# Altium project BMS_V2.1_Adv.PrjPcb (part 1 of 3)
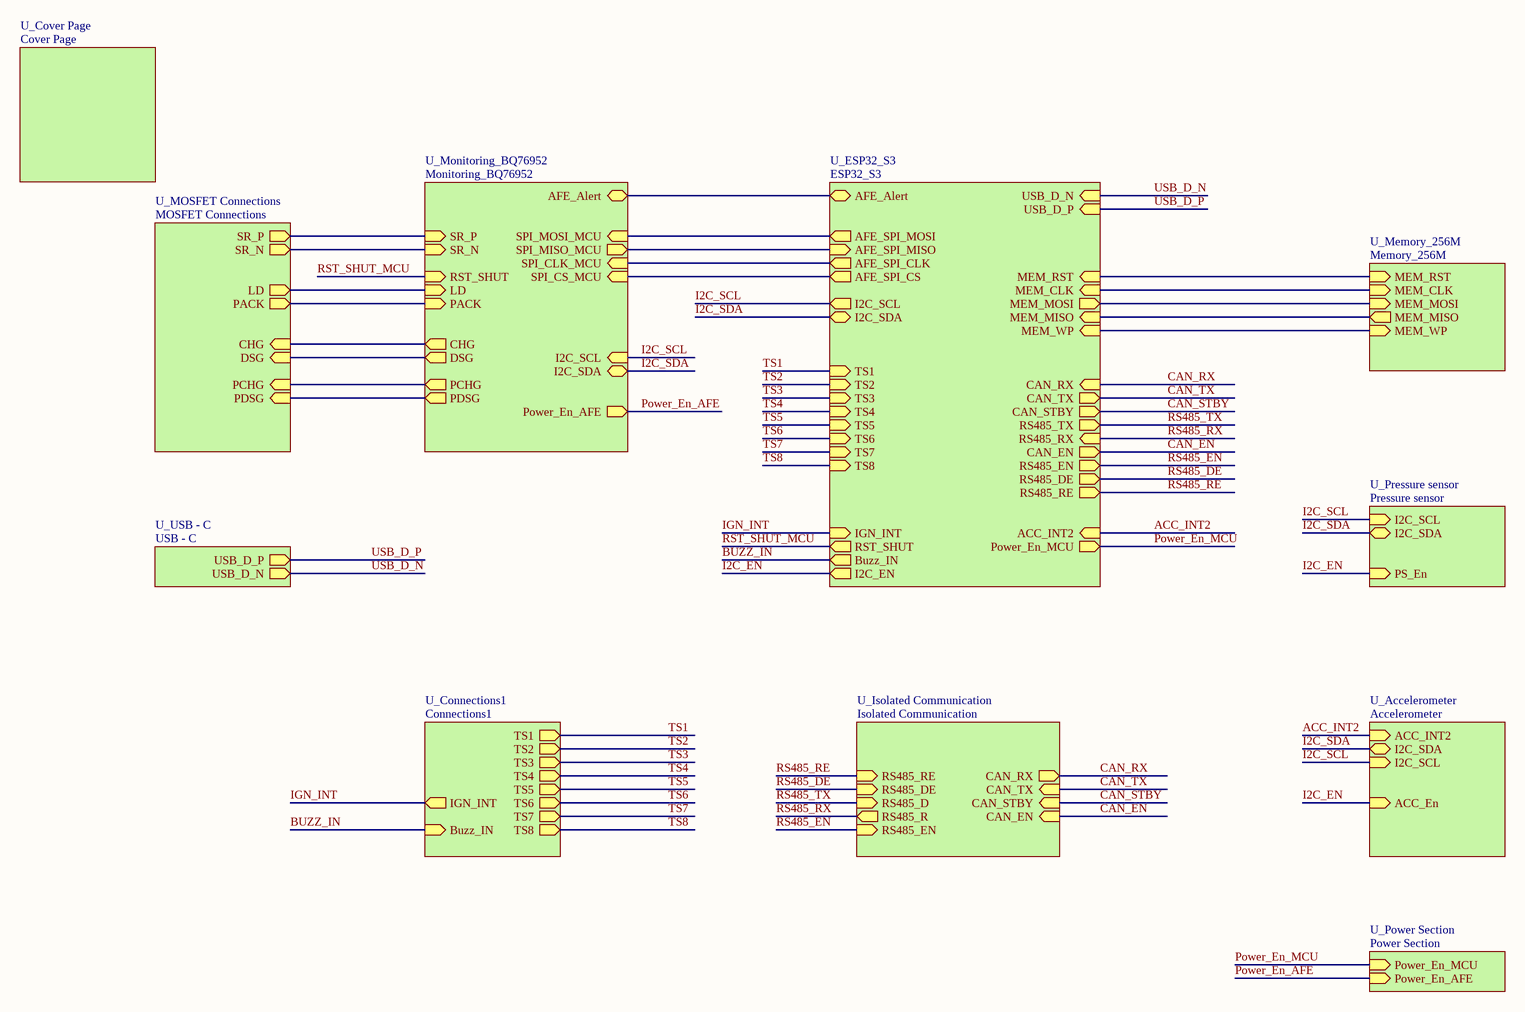
[diagram p0: Overall Connections.SchDoc]
Board Name: AlphaBMS; Configuration: 16S 100A; Configuration1: 16S 200A; Engineer: Naveenkrishna V; Revision: 0.1; Version: 1
12 sheets, 313 parts. Net scope: hierarchical (ports join the sheet entries above them; power ports are global).
Board file: BMS_V2.1_Adv.PcbDoc
Sheets:
  Overall Connections.SchDoc
    U_Cover Page = Cover Page.SchDoc
    U_Monitoring_BQ76952 = Monitoring_BQ76952.SchDoc
    U_ESP32_S3 = ESP32_S3.SchDoc
    U_Isolated Communication = Isolated Communication.SchDoc
    U_MOSFET Connections = MOSFET Connections.SchDoc
    U_USB - C = USB - C.SchDoc
    U_Power Section = Power Section.SchDoc
    U_Accelerometer = Accelerometer.SchDoc
    U_Connections1 = Connections1.SchDoc
    U_Pressure sensor = Pressure sensor.SchDoc
    U_Memory_256M = Memory_256M.SchDoc

## Sheet Overall Connections.SchDoc
size A3; SheetNumber: 1; SheetTotal: 12

### Sub-sheets
U_Accelerometer = Accelerometer: ACC_INT2 (in), I2C_SCL (in), ACC_En (in), I2C_SDA (bidir)
U_Connections1 = Connections1: TS1 (out), TS2 (out), TS3 (out), TS4 (out), TS5 (out), TS6 (out), TS7 (out), TS8 (out), Buzz_IN (in), IGN_INT (out)
U_Cover Page = Cover Page: no entries
U_ESP32_S3 = ESP32_S3: USB_D_P (in), USB_D_N (in), AFE_SPI_CS (out), AFE_SPI_MOSI (out), AFE_SPI_MISO (in), AFE_SPI_CLK (out), MEM_RST (in), MEM_MISO (in), MEM_CLK (in), MEM_WP (in), TS1 (in), TS2 (in), TS3 (in), TS4 (in), TS5 (in), TS6 (in), TS7 (in), TS8 (in), CAN_RX (in), CAN_TX (out), CAN_STBY (out), I2C_SCL (out), ACC_INT2 (in), Power_En_MCU (out), Buzz_IN (out), I2C_EN (out), MEM_MOSI (out), RST_SHUT (out), RS485_TX (out), RS485_RX (in), CAN_EN (out), RS485_EN (out), RS485_DE (out), RS485_RE (out), AFE_Alert (bidir), I2C_SDA (bidir), IGN_INT (in)
U_Isolated Communication = Isolated Communication: RS485_EN (in), RS485_RE (in), RS485_D (in), RS485_DE (in), RS485_R (out), CAN_TX (in), CAN_STBY (in), CAN_RX (out), CAN_EN (in)
U_Memory_256M = Memory_256M: MEM_RST (in), MEM_MISO (out), MEM_CLK (in), MEM_MOSI (in), MEM_WP (in)
U_Monitoring_BQ76952 = Monitoring_BQ76952: SR_P (in), SR_N (in), SPI_MOSI_MCU (in), AFE_Alert (bidir), SPI_MISO_MCU (out), SPI_CLK_MCU (in), RST_SHUT (in), CHG (out), DSG (out), SPI_CS_MCU (in), PDSG (out), PCHG (out), LD (in), PACK (in), Power_En_AFE (out), I2C_SCL (in), I2C_SDA (bidir)
U_MOSFET Connections = MOSFET Connections: SR_P (out), SR_N (out), LD (out), PACK (out), CHG (in), DSG (in), PCHG (in), PDSG (in)
U_Power Section = Power Section: Power_En_MCU (in), Power_En_AFE (in)
U_Pressure sensor = Pressure sensor: I2C_SCL (in), PS_En (in), I2C_SDA (bidir)
U_USB - C = USB - C: USB_D_P (out), USB_D_N (out)

### Nets
ACC_INT2: sheet U_ESP32_S3/ACC_INT2, sheet U_Accelerometer/ACC_INT2
BUZZ_IN: sheet U_ESP32_S3/Buzz_IN, sheet U_Connections1/Buzz_IN
CAN_EN: sheet U_ESP32_S3/CAN_EN, sheet U_Isolated Communication/CAN_EN
CAN_RX: sheet U_ESP32_S3/CAN_RX, sheet U_Isolated Communication/CAN_RX
CAN_STBY: sheet U_ESP32_S3/CAN_STBY, sheet U_Isolated Communication/CAN_STBY
CAN_TX: sheet U_ESP32_S3/CAN_TX, sheet U_Isolated Communication/CAN_TX
CHG_AFE: sheet U_Monitoring_BQ76952/CHG, sheet U_MOSFET Connections/CHG
DSG_AFE: sheet U_Monitoring_BQ76952/DSG, sheet U_MOSFET Connections/DSG
I2C_EN: sheet U_ESP32_S3/I2C_EN, sheet U_Accelerometer/ACC_En, sheet U_Pressure sensor/PS_En
I2C_SCL: sheet U_Monitoring_BQ76952/I2C_SCL, sheet U_ESP32_S3/I2C_SCL, sheet U_Accelerometer/I2C_SCL, sheet U_Pressure sensor/I2C_SCL
I2C_SDA: sheet U_Monitoring_BQ76952/I2C_SDA, sheet U_ESP32_S3/I2C_SDA, sheet U_Accelerometer/I2C_SDA, sheet U_Pressure sensor/I2C_SDA
IGN_INT: sheet U_ESP32_S3/IGN_INT, sheet U_Connections1/IGN_INT
LD_AFE: sheet U_Monitoring_BQ76952/LD, sheet U_MOSFET Connections/LD
MEM_CLK: sheet U_ESP32_S3/MEM_CLK, sheet U_Memory_256M/MEM_CLK
MEM_MISO: sheet U_ESP32_S3/MEM_MISO, sheet U_Memory_256M/MEM_MISO
MEM_MOSI: sheet U_ESP32_S3/MEM_MOSI, sheet U_Memory_256M/MEM_MOSI
MEM_RST: sheet U_ESP32_S3/MEM_RST, sheet U_Memory_256M/MEM_RST
MEM_WP: sheet U_ESP32_S3/MEM_WP, sheet U_Memory_256M/MEM_WP
PACK_AFE: sheet U_Monitoring_BQ76952/PACK, sheet U_MOSFET Connections/PACK
PCHG_AFE: sheet U_Monitoring_BQ76952/PCHG, sheet U_MOSFET Connections/PCHG
PDSG_AFE: sheet U_Monitoring_BQ76952/PDSG, sheet U_MOSFET Connections/PDSG
Power_En_AFE: sheet U_Monitoring_BQ76952/Power_En_AFE, sheet U_Power Section/Power_En_AFE
Power_En_MCU: sheet U_ESP32_S3/Power_En_MCU, sheet U_Power Section/Power_En_MCU
RS485_DE: sheet U_ESP32_S3/RS485_DE, sheet U_Isolated Communication/RS485_DE
RS485_EN: sheet U_ESP32_S3/RS485_EN, sheet U_Isolated Communication/RS485_EN
RS485_RE: sheet U_ESP32_S3/RS485_RE, sheet U_Isolated Communication/RS485_RE
RS485_RX: sheet U_ESP32_S3/RS485_RX, sheet U_Isolated Communication/RS485_R
RS485_TX: sheet U_ESP32_S3/RS485_TX, sheet U_Isolated Communication/RS485_D
RST_SHUT_MCU: sheet U_Monitoring_BQ76952/RST_SHUT, sheet U_ESP32_S3/RST_SHUT
SPI_CLK: sheet U_Monitoring_BQ76952/SPI_CLK_MCU, sheet U_ESP32_S3/AFE_SPI_CLK
SPI_CS: sheet U_Monitoring_BQ76952/SPI_CS_MCU, sheet U_ESP32_S3/AFE_SPI_CS
SPI_MISO: sheet U_Monitoring_BQ76952/SPI_MISO_MCU, sheet U_ESP32_S3/AFE_SPI_MISO
SPI_MOSI: sheet U_Monitoring_BQ76952/SPI_MOSI_MCU, sheet U_ESP32_S3/AFE_SPI_MOSI
SR_N: sheet U_Monitoring_BQ76952/SR_N, sheet U_MOSFET Connections/SR_N
SR_P: sheet U_Monitoring_BQ76952/SR_P, sheet U_MOSFET Connections/SR_P
TS1: sheet U_ESP32_S3/TS1, sheet U_Connections1/TS1
TS2: sheet U_ESP32_S3/TS2, sheet U_Connections1/TS2
TS3: sheet U_ESP32_S3/TS3, sheet U_Connections1/TS3
TS4: sheet U_ESP32_S3/TS4, sheet U_Connections1/TS4
TS5: sheet U_ESP32_S3/TS5, sheet U_Connections1/TS5
TS6: sheet U_ESP32_S3/TS6, sheet U_Connections1/TS6
TS7: sheet U_ESP32_S3/TS7, sheet U_Connections1/TS7
TS8: sheet U_ESP32_S3/TS8, sheet U_Connections1/TS8
USB_D_N: sheet U_ESP32_S3/USB_D_N, sheet U_USB - C/USB_D_N
USB_D_P: sheet U_ESP32_S3/USB_D_P, sheet U_USB - C/USB_D_P
NetU1_25: sheet U_Monitoring_BQ76952/AFE_Alert, sheet U_ESP32_S3/AFE_Alert

## Sheet Cover Page.SchDoc
size A3; SheetNumber: 2; SheetTotal: 12
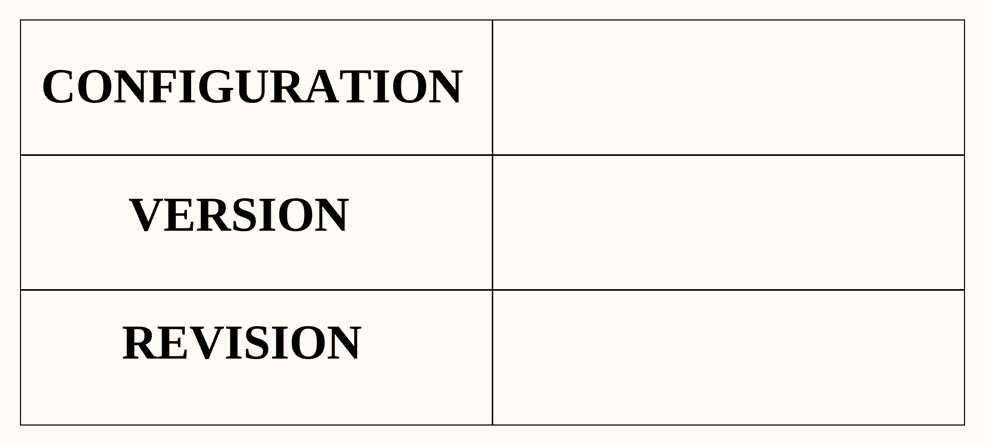
[diagram p1: Cover Page.SchDoc]

### Notes on the sheet
- CONFIGURATION
- VERSION
- REVISION

## Sheet Monitoring_BQ76952.SchDoc
size A3; SheetNumber: 4; SheetTotal: 12
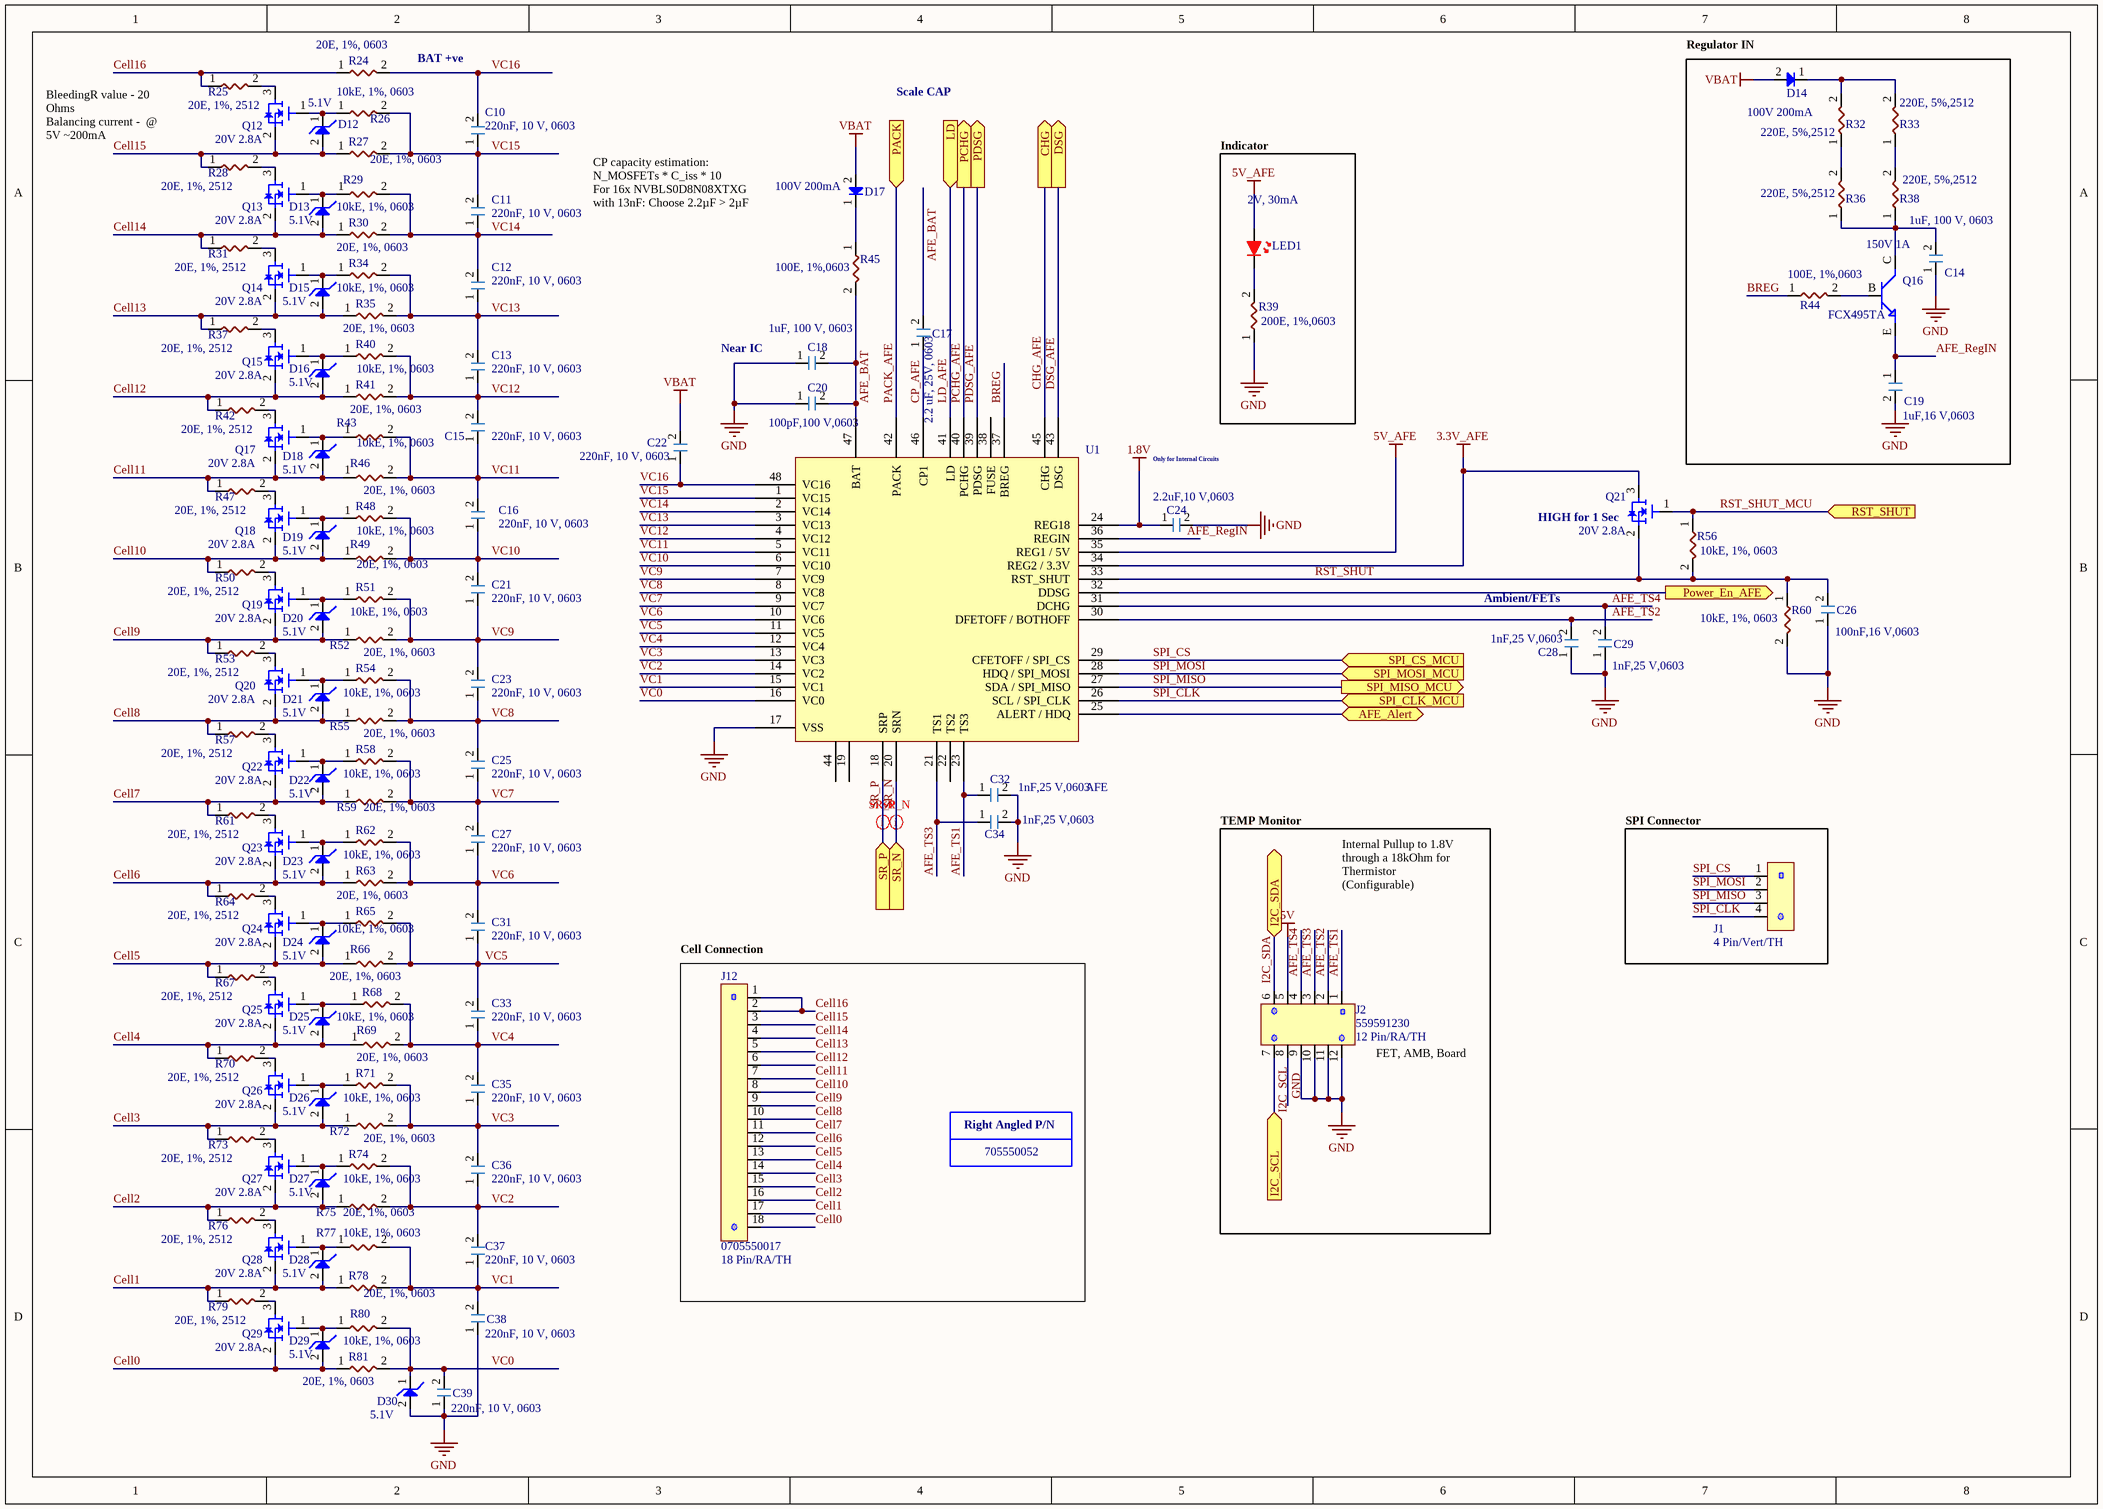
[diagram p2: Monitoring_BQ76952.SchDoc]

### Parts
C10  Value Display: 220nF, 10 V, 0603  [CAPC1608X05N 0603]  (hidden comment: GCJ188R71A224KA01D)
C11  Value Display: 220nF, 10 V, 0603  [CAPC1608X05N 0603]  (hidden comment: GCJ188R71A224KA01D)
C12  Value Display: 220nF, 10 V, 0603  [CAPC1608X05N 0603]  (hidden comment: GCJ188R71A224KA01D)
C13  Value Display: 220nF, 10 V, 0603  [CAPC1608X05N 0603]  (hidden comment: GCJ188R71A224KA01D)
C14  Value Display: 1uF, 100 V, 0603  [CAPC3216X19N 1206]  (hidden comment: GCJ31CR72A105KA01K)
C15  Value Display: 220nF, 10 V, 0603  [CAPC1608X05N 0603]  (hidden comment: GCJ188R71A224KA01D)
C16  Value Display: 220nF, 10 V, 0603  [CAPC1608X05N 0603]  (hidden comment: GCJ188R71A224KA01D)
C17  Value Display: 2.2 uF, 25V, 0603  [CAPC1608X05N 0603]  (hidden comment: GRM188Z71E225KE43D)
C18  Value Display: 1uF, 100 V, 0603  [CAPC3216X19N 1206]  (hidden comment: GCJ31CR72A105KA01K)
C19  Value Display: 1uF,16 V,0603  [CAPC1608X05N 0603]  (hidden comment: CGA3E1X7R1C105K080AC)
C20  Value Display: 100pF,100 V,0603  [CAPC1608X05N 0603]  (hidden comment: GCM1885C2A101JA16J)
C21  Value Display: 220nF, 10 V, 0603  [CAPC1608X05N 0603]  (hidden comment: GCJ188R71A224KA01D)
C22  Value Display: 220nF, 10 V, 0603  [CAPC1608X05N 0603]  (hidden comment: GCJ188R71A224KA01D)
C23  Value Display: 220nF, 10 V, 0603  [CAPC1608X05N 0603]  (hidden comment: GCJ188R71A224KA01D)
C24  Value Display: 2.2uF,10 V,0603  [CAPC1608X05N 0603]  (hidden comment: GRM188R71A225KE15D)
C25  Value Display: 220nF, 10 V, 0603  [CAPC1608X05N 0603]  (hidden comment: GCJ188R71A224KA01D)
C26  Value Display: 100nF,16 V,0603  [CAPC1608X05N 0603]  (hidden comment: CC0603KRX7R7BB104)
C27  Value Display: 220nF, 10 V, 0603  [CAPC1608X05N 0603]  (hidden comment: GCJ188R71A224KA01D)
C28  Value Display: 1nF,25 V,0603  [CAPC1608X05N 0603]  (hidden comment: C0603C102J3GACAUTO)
C29  Value Display: 1nF,25 V,0603  [CAPC1608X05N 0603]  (hidden comment: C0603C102J3GACAUTO)
C31  Value Display: 220nF, 10 V, 0603  [CAPC1608X05N 0603]  (hidden comment: GCJ188R71A224KA01D)
C32  Value Display: 1nF,25 V,0603  [CAPC1608X05N 0603]  (hidden comment: C0603C102J3GACAUTO)
C33  Value Display: 220nF, 10 V, 0603  [CAPC1608X05N 0603]  (hidden comment: GCJ188R71A224KA01D)
C34  Value Display: 1nF,25 V,0603  [CAPC1608X05N 0603]  (hidden comment: C0603C102J3GACAUTO)
C35  Value Display: 220nF, 10 V, 0603  [CAPC1608X05N 0603]  (hidden comment: GCJ188R71A224KA01D)
C36  Value Display: 220nF, 10 V, 0603  [CAPC1608X05N 0603]  (hidden comment: GCJ188R71A224KA01D)
C37  Value Display: 220nF, 10 V, 0603  [CAPC1608X05N 0603]  (hidden comment: GCJ188R71A224KA01D)
C38  Value Display: 220nF, 10 V, 0603  [CAPC1608X05N 0603]  (hidden comment: GCJ188R71A224KA01D)
C39  Value Display: 220nF, 10 V, 0603  [CAPC1608X05N 0603]  (hidden comment: GCJ188R71A224KA01D)
D12  Value Display: 5.1V  [DIODE_SOD323]  (hidden comment: MM3Z5V1ST1G)
D13  Value Display: 5.1V  [DIODE_SOD323]  (hidden comment: MM3Z5V1ST1G)
D14  Value Display: 100V 200mA  [DIODE_SOD323]  (hidden comment: SBAS16HT1G)
D15  Value Display: 5.1V  [DIODE_SOD323]  (hidden comment: MM3Z5V1ST1G)
D16  Value Display: 5.1V  [DIODE_SOD323]  (hidden comment: MM3Z5V1ST1G)
D17  Value Display: 100V 200mA  [DIODE_SOD323]  (hidden comment: SBAS16HT1G)
D18  Value Display: 5.1V  [DIODE_SOD323]  (hidden comment: MM3Z5V1ST1G)
D19  Value Display: 5.1V  [DIODE_SOD323]  (hidden comment: MM3Z5V1ST1G)
D20  Value Display: 5.1V  [DIODE_SOD323]  (hidden comment: MM3Z5V1ST1G)
D21  Value Display: 5.1V  [DIODE_SOD323]  (hidden comment: MM3Z5V1ST1G)
D22  Value Display: 5.1V  [DIODE_SOD323]  (hidden comment: MM3Z5V1ST1G)
D23  Value Display: 5.1V  [DIODE_SOD323]  (hidden comment: MM3Z5V1ST1G)
D24  Value Display: 5.1V  [DIODE_SOD323]  (hidden comment: MM3Z5V1ST1G)
D25  Value Display: 5.1V  [DIODE_SOD323]  (hidden comment: MM3Z5V1ST1G)
D26  Value Display: 5.1V  [DIODE_SOD323]  (hidden comment: MM3Z5V1ST1G)
D27  Value Display: 5.1V  [DIODE_SOD323]  (hidden comment: MM3Z5V1ST1G)
D28  Value Display: 5.1V  [DIODE_SOD323]  (hidden comment: MM3Z5V1ST1G)
D29  Value Display: 5.1V  [DIODE_SOD323]  (hidden comment: MM3Z5V1ST1G)
D30  Value Display: 5.1V  [DIODE_SOD323]  (hidden comment: MM3Z5V1ST1G)
J1  Value Display: 4 Pin/Vert/TH  [Con_61900411121]  (hidden comment: 61900411121)
J2  559591230  Value Display: 12 Pin/RA/TH  [Con_0559591230]
J12  0705550017  Value Display: 18 Pin/RA/TH  [Con_705550017]
LED1  Value Display: 2V, 30mA  [DIOC1610X08N LED]  (hidden comment: 150060RS75000)
Q12  Value Display: 20V 2.8A  [SOT95P255X140-3N]  (hidden comment: DMG2302UK-7)
Q13  Value Display: 20V 2.8A  [SOT95P255X140-3N]  (hidden comment: DMG2302UK-7)
Q14  Value Display: 20V 2.8A  [SOT95P255X140-3N]  (hidden comment: DMG2302UK-7)
Q15  Value Display: 20V 2.8A  [SOT95P255X140-3N]  (hidden comment: DMG2302UK-7)
Q16  FCX495TA  Value Display: 150V 1A  [SOT89-150P410X160-3N]
Q17  Value Display: 20V 2.8A  [SOT95P255X140-3N]  (hidden comment: DMG2302UK-7)
Q18  Value Display: 20V 2.8A  [SOT95P255X140-3N]  (hidden comment: DMG2302UK-7)
Q19  Value Display: 20V 2.8A  [SOT95P255X140-3N]  (hidden comment: DMG2302UK-7)
Q20  Value Display: 20V 2.8A  [SOT95P255X140-3N]  (hidden comment: DMG2302UK-7)
Q21  Value Display: 20V 2.8A  [SOT95P255X140-3N]  (hidden comment: DMG2302UK-7)
Q22  Value Display: 20V 2.8A  [SOT95P255X140-3N]  (hidden comment: DMG2302UK-7)
Q23  Value Display: 20V 2.8A  [SOT95P255X140-3N]  (hidden comment: DMG2302UK-7)
Q24  Value Display: 20V 2.8A  [SOT95P255X140-3N]  (hidden comment: DMG2302UK-7)
Q25  Value Display: 20V 2.8A  [SOT95P255X140-3N]  (hidden comment: DMG2302UK-7)
Q26  Value Display: 20V 2.8A  [SOT95P255X140-3N]  (hidden comment: DMG2302UK-7)
Q27  Value Display: 20V 2.8A  [SOT95P255X140-3N]  (hidden comment: DMG2302UK-7)
Q28  Value Display: 20V 2.8A  [SOT95P255X140-3N]  (hidden comment: DMG2302UK-7)
Q29  Value Display: 20V 2.8A  [SOT95P255X140-3N]  (hidden comment: DMG2302UK-7)
R24  Value Display: 20E, 1%, 0603  [RESC1608X05N 0603]  (hidden comment: CRCW060320R0FKEAHP)
R25  Value Display: 20E, 1%, 2512  [RESC6332X07N 2512]  (hidden comment: RC2512FK-0720RL)
R26  Value Display: 10kE, 1%, 0603  [RESC1608X05N 0603]  (hidden comment: CRCW060310K0FKEA)
R27  Value Display: 20E, 1%, 0603  [RESC1608X05N 0603]  (hidden comment: CRCW060320R0FKEAHP)
R28  Value Display: 20E, 1%, 2512  [RESC6332X07N 2512]  (hidden comment: RC2512FK-0720RL)
R29  Value Display: 10kE, 1%, 0603  [RESC1608X05N 0603]  (hidden comment: CRCW060310K0FKEA)
R30  Value Display: 20E, 1%, 0603  [RESC1608X05N 0603]  (hidden comment: CRCW060320R0FKEAHP)
R31  Value Display: 20E, 1%, 2512  [RESC6332X07N 2512]  (hidden comment: RC2512FK-0720RL)
R32  Value Display: 220E, 5%,2512  [RESC6332X07N 2512]  (hidden comment: CRCW2512220RJNEG)
R33  Value Display: 220E, 5%,2512  [RESC6332X07N 2512]  (hidden comment: CRCW2512220RJNEG)
R34  Value Display: 10kE, 1%, 0603  [RESC1608X05N 0603]  (hidden comment: CRCW060310K0FKEA)
R35  Value Display: 20E, 1%, 0603  [RESC1608X05N 0603]  (hidden comment: CRCW060320R0FKEAHP)
R36  Value Display: 220E, 5%,2512  [RESC6332X07N 2512]  (hidden comment: CRCW2512220RJNEG)
R37  Value Display: 20E, 1%, 2512  [RESC6332X07N 2512]  (hidden comment: RC2512FK-0720RL)
R38  Value Display: 220E, 5%,2512  [RESC6332X07N 2512]  (hidden comment: CRCW2512220RJNEG)
R39  Value Display: 200E, 1%,0603  [RESC1608X05N 0603]  (hidden comment: AC0603FR-10200RL)
R40  Value Display: 10kE, 1%, 0603  [RESC1608X05N 0603]  (hidden comment: CRCW060310K0FKEA)
R41  Value Display: 20E, 1%, 0603  [RESC1608X05N 0603]  (hidden comment: CRCW060320R0FKEAHP)
R42  Value Display: 20E, 1%, 2512  [RESC6332X07N 2512]  (hidden comment: RC2512FK-0720RL)
R43  Value Display: 10kE, 1%, 0603  [RESC1608X05N 0603]  (hidden comment: CRCW060310K0FKEA)
R44  Value Display: 100E, 1%,0603  [RESC1608X05N 0603]  (hidden comment: AF0603FR-07100RL)
R45  Value Display: 100E, 1%,0603  [RESC1608X05N 0603]  (hidden comment: AF0603FR-07100RL)
R46  Value Display: 20E, 1%, 0603  [RESC1608X05N 0603]  (hidden comment: CRCW060320R0FKEAHP)
R47  Value Display: 20E, 1%, 2512  [RESC6332X07N 2512]  (hidden comment: RC2512FK-0720RL)
R48  Value Display: 10kE, 1%, 0603  [RESC1608X05N 0603]  (hidden comment: CRCW060310K0FKEA)
R49  Value Display: 20E, 1%, 0603  [RESC1608X05N 0603]  (hidden comment: CRCW060320R0FKEAHP)
R50  Value Display: 20E, 1%, 2512  [RESC6332X07N 2512]  (hidden comment: RC2512FK-0720RL)
R51  Value Display: 10kE, 1%, 0603  [RESC1608X05N 0603]  (hidden comment: CRCW060310K0FKEA)
R52  Value Display: 20E, 1%, 0603  [RESC1608X05N 0603]  (hidden comment: CRCW060320R0FKEAHP)
R53  Value Display: 20E, 1%, 2512  [RESC6332X07N 2512]  (hidden comment: RC2512FK-0720RL)
R54  Value Display: 10kE, 1%, 0603  [RESC1608X05N 0603]  (hidden comment: CRCW060310K0FKEA)
R55  Value Display: 20E, 1%, 0603  [RESC1608X05N 0603]  (hidden comment: CRCW060320R0FKEAHP)
R56  Value Display: 10kE, 1%, 0603  [RESC1608X05N 0603]  (hidden comment: CRCW060310K0FKEA)
R57  Value Display: 20E, 1%, 2512  [RESC6332X07N 2512]  (hidden comment: RC2512FK-0720RL)
R58  Value Display: 10kE, 1%, 0603  [RESC1608X05N 0603]  (hidden comment: CRCW060310K0FKEA)
R59  Value Display: 20E, 1%, 0603  [RESC1608X05N 0603]  (hidden comment: CRCW060320R0FKEAHP)
R60  Value Display: 10kE, 1%, 0603  [RESC1608X05N 0603]  (hidden comment: CRCW060310K0FKEA)
R61  Value Display: 20E, 1%, 2512  [RESC6332X07N 2512]  (hidden comment: RC2512FK-0720RL)
R62  Value Display: 10kE, 1%, 0603  [RESC1608X05N 0603]  (hidden comment: CRCW060310K0FKEA)
R63  Value Display: 20E, 1%, 0603  [RESC1608X05N 0603]  (hidden comment: CRCW060320R0FKEAHP)
R64  Value Display: 20E, 1%, 2512  [RESC6332X07N 2512]  (hidden comment: RC2512FK-0720RL)
R65  Value Display: 10kE, 1%, 0603  [RESC1608X05N 0603]  (hidden comment: CRCW060310K0FKEA)
R66  Value Display: 20E, 1%, 0603  [RESC1608X05N 0603]  (hidden comment: CRCW060320R0FKEAHP)
R67  Value Display: 20E, 1%, 2512  [RESC6332X07N 2512]  (hidden comment: RC2512FK-0720RL)
R68  Value Display: 10kE, 1%, 0603  [RESC1608X05N 0603]  (hidden comment: CRCW060310K0FKEA)
R69  Value Display: 20E, 1%, 0603  [RESC1608X05N 0603]  (hidden comment: CRCW060320R0FKEAHP)
R70  Value Display: 20E, 1%, 2512  [RESC6332X07N 2512]  (hidden comment: RC2512FK-0720RL)
R71  Value Display: 10kE, 1%, 0603  [RESC1608X05N 0603]  (hidden comment: CRCW060310K0FKEA)
R72  Value Display: 20E, 1%, 0603  [RESC1608X05N 0603]  (hidden comment: CRCW060320R0FKEAHP)
R73  Value Display: 20E, 1%, 2512  [RESC6332X07N 2512]  (hidden comment: RC2512FK-0720RL)
R74  Value Display: 10kE, 1%, 0603  [RESC1608X05N 0603]  (hidden comment: CRCW060310K0FKEA)
R75  Value Display: 20E, 1%, 0603  [RESC1608X05N 0603]  (hidden comment: CRCW060320R0FKEAHP)
R76  Value Display: 20E, 1%, 2512  [RESC6332X07N 2512]  (hidden comment: RC2512FK-0720RL)
R77  Value Display: 10kE, 1%, 0603  [RESC1608X05N 0603]  (hidden comment: CRCW060310K0FKEA)
R78  Value Display: 20E, 1%, 0603  [RESC1608X05N 0603]  (hidden comment: CRCW060320R0FKEAHP)
R79  Value Display: 20E, 1%, 2512  [RESC6332X07N 2512]  (hidden comment: RC2512FK-0720RL)
R80  Value Display: 10kE, 1%, 0603  [RESC1608X05N 0603]  (hidden comment: CRCW060310K0FKEA)
R81  Value Display: 20E, 1%, 0603  [RESC1608X05N 0603]  (hidden comment: CRCW060320R0FKEAHP)
U1  Value Display: AFE  [TSQFP50P900X900X120-48N]  (hidden comment: BQ7695203)

### Blocks framed on the sheet
Regulator IN: C14 C19 D14 Q16 R32 R33 R36 R38 R44
Indicator: LED1 R39
TEMP Monitor: J2
SPI Connector: J1

### Ports
AFE_Alert (bidir), CHG (out), DSG (out), I2C_SCL (in), I2C_SDA (bidir), LD (in), PACK (in), PCHG (out), PDSG (out), Power_En_AFE (out), RST_SHUT (in), SPI_CLK_MCU (in), SPI_CS_MCU (in), SPI_MISO_MCU (out), SPI_MOSI_MCU (in), SR_N (in), SR_P (in)

### Nets
1.8V: C24.1 U1.24(REG18)
3.3V_AFE: Q21.3(Drain) U1.34(REG2_/_3.3V)
5V: J2.5
5V_AFE: LED1.2(Anode) U1.35(REG1_/_5V)
GND: C14.1 C18.1 C19.2 C20.1 C24.2 C26.1 C28.1 C29.1 C32.2 C34.2 C38.1 C39.1 D30.2(Anode) J2.8 J2.9 J2.10 J2.11 J2.12 R39.1 R60.2 U1.17(VSS)
VBAT: C22.2 D14.2(Anode) D17.2(Anode)
AFE_BAT: C17.2 C18.2 C20.2 R45.2 U1.47(BAT)
AFE_RegIN: C19.1 Q16.E(Emitter) U1.36(REGIN)
AFE_TS1: C32.1 J2.1 U1.23(TS3)
AFE_TS2: C28.2 J2.2 U1.30(DFETOFF_/_BOTHOFF)
AFE_TS3: C34.1 J2.3 U1.21(TS1)
AFE_TS4: C29.2 J2.4 U1.31(DCHG)
BREG: R44.1 U1.37(BREG)
Cell0: D29.2(Anode) J12.18(Cell_17) Q29.2(Source) R81.1
Cell1: D28.2(Anode) J12.17(Cell_16) Q28.2(Source) R78.1 R79.1
Cell2: D27.2(Anode) J12.16(Cell_15) Q27.2(Source) R75.1 R76.1
Cell3: D26.2(Anode) J12.15(Cell_14) Q26.2(Source) R72.1 R73.1
Cell4: D25.2(Anode) J12.14(Cell_13) Q25.2(Source) R69.1 R70.1
Cell5: D24.2(Anode) J12.13(Cell_12) Q24.2(Source) R66.1 R67.1
Cell6: D23.2(Anode) J12.12(Cell_11) Q23.2(Source) R63.1 R64.1
Cell7: D22.2(Anode) J12.11(Cell_10) Q22.2(Source) R59.1 R61.1
Cell8: D21.2(Anode) J12.10(Cell_9) Q20.2(Source) R55.1 R57.1
Cell9: D20.2(Anode) J12.9(Cell_8) Q19.2(Source) R52.1 R53.1
Cell10: D19.2(Anode) J12.8(Cell_7) Q18.2(Source) R49.1 R50.1
Cell11: D18.2(Anode) J12.7(Cell_6) Q17.2(Source) R46.1 R47.1
Cell12: D16.2(Anode) J12.6(Cell_5) Q15.2(Source) R41.1 R42.1
Cell13: D15.2(Anode) J12.5(Cell_4) Q14.2(Source) R35.1 R37.1
Cell14: D13.2(Anode) J12.4(Cell_3) Q13.2(Source) R30.1 R31.1
Cell15: D12.2(Anode) J12.3(Cell_2) Q12.2(Source) R27.1 R28.1
Cell16: J12.1(Cell_0) J12.2(Cell_1) R24.1 R25.1
CHG_AFE: U1.45(CHG) ; port CHG
CP_AFE: C17.1 U1.46(CP1)
DSG_AFE: U1.43(DSG) ; port DSG
I2C_SCL: J2.7 ; port I2C_SCL
I2C_SDA: J2.6 ; port I2C_SDA
LD_AFE: U1.41(LD) ; port LD
PACK_AFE: U1.42(PACK) ; port PACK
PCHG_AFE: U1.40(PCHG) ; port PCHG
PDSG_AFE: U1.39(PDSG) ; port PDSG
Power_En_AFE: U1.32(DDSG) ; port Power_En_AFE
RST_SHUT: C26.2 Q21.2(Source) R56.2 R60.1 U1.33(RST_SHUT)
RST_SHUT_MCU: Q21.1(Gate) R56.1 ; port RST_SHUT
SPI_CLK: J1.4 U1.26(SCL_/_SPI_CLK) ; port SPI_CLK_MCU
SPI_CS: J1.1 U1.29(CFETOFF_/_SPI_CS) ; port SPI_CS_MCU
SPI_MISO: J1.3 U1.27(SDA_/_SPI_MISO) ; port SPI_MISO_MCU
SPI_MOSI: J1.2 U1.28(HDQ_/_SPI_MOSI) ; port SPI_MOSI_MCU
SR_N: U1.20(SRN) ; port SR_N
SR_P: U1.18(SRP) ; port SR_P
VC0: C39.2 D30.1(Cathode) R80.2 R81.2 U1.16(VC0)
VC1: C37.1 C38.2 R77.2 R78.2 U1.15(VC1)
VC2: C36.1 C37.2 R74.2 R75.2 U1.14(VC2)
VC3: C35.1 C36.2 R71.2 R72.2 U1.13(VC3)
VC4: C33.1 C35.2 R68.2 R69.2 U1.12(VC4)
VC5: C31.1 C33.2 R65.2 R66.2 U1.11(VC5)
VC6: C27.1 C31.2 R62.2 R63.2 U1.10(VC6)
VC7: C25.1 C27.2 R58.2 R59.2 U1.9(VC7)
VC8: C23.1 C25.2 R54.2 R55.2 U1.8(VC8)
VC9: C21.1 C23.2 R51.2 R52.2 U1.7(VC9)
VC10: C16.1 C21.2 R48.2 R49.2 U1.6(VC10)
VC11: C15.1 C16.2 R43.2 R46.2 U1.5(VC11)
VC12: C13.1 C15.2 R40.2 R41.2 U1.4(VC12)
VC13: C12.1 C13.2 R34.2 R35.2 U1.3(VC13)
VC14: C11.1 C12.2 R29.2 R30.2 U1.2(VC14)
VC15: C10.1 C11.2 R26.2 R27.2 U1.1(VC15)
VC16: C10.2 C22.1 R24.2 U1.48(VC16)
NetC14_2: C14.2 Q16.C(Collector) R36.1 R38.1
NetD12_1: D12.1(Cathode) Q12.1(Gate) R26.1
NetD13_1: D13.1(Cathode) Q13.1(Gate) R29.1
NetD14_1: D14.1(Cathode) R32.2 R33.2
NetD15_1: D15.1(Cathode) Q14.1(Gate) R34.1
NetD16_1: D16.1(Cathode) Q15.1(Gate) R40.1
NetD17_1: D17.1(Cathode) R45.1
NetD18_1: D18.1(Cathode) Q17.1(Gate) R43.1
NetD19_1: D19.1(Cathode) Q18.1(Gate) R48.1
NetD20_1: D20.1(Cathode) Q19.1(Gate) R51.1
NetD21_1: D21.1(Cathode) Q20.1(Gate) R54.1
NetD22_1: D22.1(Cathode) Q22.1(Gate) R58.1
NetD23_1: D23.1(Cathode) Q23.1(Gate) R62.1
NetD24_1: D24.1(Cathode) Q24.1(Gate) R65.1
NetD25_1: D25.1(Cathode) Q25.1(Gate) R68.1
NetD26_1: D26.1(Cathode) Q26.1(Gate) R71.1
NetD27_1: D27.1(Cathode) Q27.1(Gate) R74.1
NetD28_1: D28.1(Cathode) Q28.1(Gate) R77.1
NetD29_1: D29.1(Cathode) Q29.1(Gate) R80.1
NetLED1_1: LED1.1(Cathode) R39.2
NetQ12_3: Q12.3(Drain) R25.2
NetQ13_3: Q13.3(Drain) R28.2
NetQ14_3: Q14.3(Drain) R31.2
NetQ15_3: Q15.3(Drain) R37.2
NetQ16_B: Q16.B(Base) R44.2
NetQ17_3: Q17.3(Drain) R42.2
NetQ18_3: Q18.3(Drain) R47.2
NetQ19_3: Q19.3(Drain) R50.2
NetQ20_3: Q20.3(Drain) R53.2
NetQ22_3: Q22.3(Drain) R57.2
NetQ23_3: Q23.3(Drain) R61.2
NetQ24_3: Q24.3(Drain) R64.2
NetQ25_3: Q25.3(Drain) R67.2
NetQ26_3: Q26.3(Drain) R70.2
NetQ27_3: Q27.3(Drain) R73.2
NetQ28_3: Q28.3(Drain) R76.2
NetQ29_3: Q29.3(Drain) R79.2
NetR32_1: R32.1 R36.2
NetR33_1: R33.1 R38.2
NetU1_25: U1.25(ALERT_/_HDQ) ; port AFE_Alert

Not connected (* = marked no-connect by the designer): U1 19 22(TS2) 38(FUSE) 44

### Layout directives
differential pair: SR_N, SR_P

### Notes on the sheet
- BAT +ve
- Scale CAP
- BleedingR value - 20 Ohms
  Balancing current -  @ 5V ~200mA
- CP capacity estimation: N_MOSFETs * C_iss * 10
  For 16x NVBLS0D8N08XTXG with 13nF: Choose 2.2µF > 2µF
- Near IC
- Only for Internal Circuits
- (near Q21) HIGH for 1 Sec
- Ambient/FETs
- Internal Pullup to 1.8V through a 18kOhm for  Thermistor (Configurable)
- (near J12) Cell Connection
- (near J2) FET, AMB, Board
- Right Angled P/N
- 705550052

### Library data of the parts
C10-C13 C15 C16 C21-C23 C25 C27 C31 C33 C35-C39 = Cap_GCJ188R71A224KA01D: Multilayer Ceramic Capacitor, 220 nF, 10V, ±10%,  X7R 0603 [1608 Metric]; Manufacturer: Murata; Value: 220 nF; AEC-Q: 200; Max Temp: 125 degC; Min Temp: -55 degC; Polarized: No; Manufacturer Part Number: GCJ188R71A224KA01D; Tolerance: 10%; Package: 0603; Category: Capacitor; RoHS: Yes; Voltage: 10V; Supplier: Mouser; ComponentLink1Description: Datasheet; ComponentLink1URL: https://search.murata.co.jp/Ceramy/image/img/A01X/G101/ENG/GCJ188R71A224KA01-02B.pdf; Temp Coefficient: X7R; Supplier 1 pricing per Unit: 16.28 INR; Supplier 1: Digikey; Value 1: GCJ188R71A224KA01D; Supplier 1 Part Number: 490-GCJ188R71A224KA01DTR-ND; Supplier Part Number: 81-GCJ188R71A224KA1D; Supplier pricing per Unit: 12.51 INR; Mount Type: Surface Mount; Technology: Ceramic
C14 C18 = Cap_GCJ31CR72A105KA01K: Multilayer Ceramic Capacitor, 1uF, 100V, ±10%,  X7R 1206 [3216 Metric]; Manufacturer: Murata; AEC-Q: 200; Max Temp: 125 degC; Min Temp: -55 degC; Polarized: No; Value: 1uF; Tolerance: 10%; Manufacturer Part Number: GCJ31CR72A105KA01K; Package: 1206; Category: Capacitor; Voltage: 100V; Temp Coefficient: X7R; RoHS: Yes; Supplier: Mouser; Supplier 1 pricing per Unit: 40.02 INR; ComponentLink1Description: Datasheet; ComponentLink1URL: https://search.murata.co.jp/Ceramy/image/img/A01X/G101/ENG/GCJ31CR72A105KA01-01.pdf; Supplier 1: Digikey; Value 1: GCJ31CR72A105KA01K; Supplier 1 Part Number: 490-GCJ31CR72A105KA01KCT-ND; Supplier Part Number: 81-GCJ31CR72A105KA1K; Supplier pricing per Unit: 40.3 INR; Mount Type: Surface Mount; Technology: Ceramic
C17 = Cap_GRM188Z71E225KE43D: 2.2 µF ±10% 25V Ceramic Capacitor X7R 0603 (1608 Metric); Manufacturer: Murata; AEC-Q: NA; Max Temp: 125 degC; Min Temp: -55 degC; Polarized: No; Value: 2.2uF; Category: Capacitor; ComponentLink1Description: Datasheet; ComponentLink1URL: https://search.murata.co.jp/Ceramy/image/img/A01X/G101/ENG/GRM188Z71E225KE43-01A.pdf; Manufacturer Part Number: GRM188Z71E225KE43D; Mount Type: Surface Mount; Package: 0603; RoHS: Yes; Supplier 1: Digikey; Supplier 1 Part Number: 490-GRM188Z71E225KE43DCT-ND; Supplier 1 pricing per Unit: 19.34 INR; Supplier: Mouser; Supplier Part Number: 81-GRM188Z71E225KE3D; Supplier pricing per Unit: 19.18 INR; Technology: Ceramic; Temp Coefficient: X7R; Tolerance: 10%; Value 1: GRM188Z71E225KE43D; Voltage: 25V
C19 = Cap_CGA3E1X7R1C105K080AC: Multilayer Ceramic Capacitor, 1uF, 16V, ±10%,  X7R 0603 [1608 Metric]; Manufacturer: TDK Corporation; Polarized: No; AEC-Q: 200; Min Temp: -55 degC; Max Temp: 125 degC; Value: 1 uF; Manufacturer Part Number: CGA3E1X7R1C105K080AC; Package: 0603; RoHS: Yes; Mount Type: Surface Mount; Supplier 1: Digikey; Voltage: 16V; Tolerance: 10%; Technology: Ceramic; Value 1: CGA3E1X7R1C105K080AC; Category: Capacitor; ComponentLink1Description: Datasheet; ComponentLink1URL: https://product.tdk.com/system/files/dam/doc/product/capacitor/ceramic/mlcc/catalog/mlcc_automotive_general_en.pdf; Supplier 1 Part Number: 445-12539-1-ND; Supplier 1 pricing per Unit: 10.84 INR; Supplier: Mouser; Supplier Part Number: 810-CGA3E1X7R1C105AC; Supplier pricing per Unit: 10.01 INR; Temp Coefficient: X7R
C20 = Cap_GCM1885C2A101JA16J: Multilayer Ceramic Capacitor, 100 pF, 100V, ±5%,  C0G 0603 [1608 Metric]; Manufacturer: Murata; Value: 100pF; AEC-Q: 200; Max Temp: 125 degC; Min Temp: -55 degC; Polarized: No; Category: Capacitor; Tolerance: 5%; Voltage: 100V; Manufacturer Part Number: GCM1885C2A101JA16J; Package: 0603; RoHS: Yes; Supplier: Mouser; ComponentLink1Description: Datasheet; ComponentLink1URL: https://www.murata.com/-/media/webrenewal/support/library/catalog/products/k35e.ashx?la=en-us&cvid=20200508021757000000; Temp Coefficient: C0G; Supplier 1 pricing per Unit: 8.33 INR; Supplier 1: Digikey; Value 1: GCM1885C2A101JA16J; Supplier 1 Part Number: 490-GCM1885C2A101JA16JCT-ND; Supplier Part Number: 81-GCM1885C2A101JA6J; Supplier pricing per Unit: 8.33 INR; Mount Type: Surface Mount; Technology: Ceramic
C24 = Cap_GRM188R71A225KE15D: Multilayer Ceramic Capacitor, 2.2 uF, 10 V, ± 10%, X7R, 0603 [1608 Metric]; Manufacturer: Murata; Value: 2.2uF; Voltage: 10V; AEC-Q: NA; Max Temp: 125 degC; Min Temp: -55 degC; Polarized: No; Manufacturer Part Number: GRM188R71A225KE15D; RoHS: Yes; Category: Capacitor; Package: 0603; Tolerance: 10%; ComponentLink1Description: Datasheet; Supplier: Mouser; ComponentLink1URL: https://www.murata.com/-/media/webrenewal/support/library/catalog/products/k35e.ashx?la=en-us&cvid=20200508021757000000; Temp Coefficient: X7R; Supplier 1 pricing per Unit: 15.00 INR; Supplier 1: Digikey; Value 1: GRM188R71A225KE15D; Supplier 1 Part Number: 490-4520-1-ND; Supplier Part Number: 81-GRM188R71A225KE15; Supplier pricing per Unit: 13.34 INR; Mount Type: Surface Mount; Technology: Ceramic
C26 = Cap_CC0603KRX7R7BB104: Multilayer Ceramic Capacitor, 100 nF, 16V, ±10%,  X7R 0603 [1608 Metric]; Manufacturer: Yageo; Value: 100nF; Max Temp: 125 degC; Min Temp: -55 degC; Polarized: No; AEC-Q: NA; Manufacturer Part Number: CC0603KRX7R7BB104; Category: Capacitor; ComponentLink1Description: Datasheet; Mount Type: Surface Mount; Package: 0603; RoHS: Yes; Supplier 1: Digikey; Supplier 1 Part Number: 311-1088-1-ND; Supplier 1 pricing per Unit: 8.34 INR; Supplier: Mouser; Supplier Part Number: 603-CC603KRX7R7BB104; Supplier pricing per Unit: 8.34 INR; Technology: Ceramic; Temp Coefficient: X7R; Tolerance: 10%; Value 1: CC0603KRX7R7BB104; Voltage: 16V; ComponentLink1URL: https://www.yageo.com/upload/media/product/productsearch/datasheet/mlcc/UPY-GPHC_X7R_6.3V-to-250V_24.pdf
C28 C29 C32 C34 = Cap_C0603C102J3GACAUTO: Multilayer Ceramic Capacitor, 1000 pF, 25V, ±5%,  C0G 0603 [1608 Metric]; Manufacturer: KEMET; Value: 1nF; Max Temp: 125 degC; Min Temp: -55 degC; Polarized: No; Temp Coefficient: C0G, NP0; AEC-Q: 200; Manufacturer Part Number: C0603C102J3GACAUTO; Voltage: 25V; Category: Capacitor; ComponentLink1Description: Datasheet; Mount Type: Surface Mount; Package: 0603; RoHS: Yes; Supplier 1: Digikey; Supplier 1 Part Number: 399-C0603C102J3GACAUTOCT-ND; Supplier 1 pricing per Unit: 9.17 INR; Supplier: Mouser; Supplier Part Number: 80-C0603C102J3GAUTO; Supplier pricing per Unit: 8.34 INR; Technology: Ceramic; Tolerance: 5%; Value 1: C0603C102J3GACAUTO; ComponentLink1URL: https://connect.kemet.com:7667/gateway/IntelliData-ComponentDocumentation/1.0/download/datasheet/C0603C102J3GACAUTO
D12 D13 D15 D16 D18-D30 = Diode_MM3Z5V1ST1G: Zener Diode 5.6 V 300 mW ±2% Surface Mount SOD-323; Manufacturer: OnSemi; AEC-Q: NA; Forward Current: 2uA; Forward Voltage: 900 mV @ 5 mA; Max Temp: 150 degC; Min Temp: -65 degC; Power: 300mW; Value 1: MM3Z5V1ST1GOSCT-ND; Value: 5.1V; Category: Diode; ComponentLink1Description: Datasheet; ComponentLink1URL: https://www.onsemi.com/pdf/datasheet/mm3z2v4st1-d.pdf; Manufacturer Part Number: MM3Z5V1ST1G; Mount Type: Surface Mount; Package: SOD-323-2; RoHS: Yes; Supplier 1: Digikey; Supplier 1 Part Number: MM3Z5V1ST1GOSCT-ND; Supplier 1 pricing per Unit: 8.38 INR; Supplier: Mouser; Supplier Part Number: 863-MM3Z5V1ST1G; Supplier pricing per Unit: 10.01 INR; Voltage: 5.1V
D14 D17 = Diode_SBAS16HT1G: DIODE GEN PURP 100V 200MA SOD323; Manufacturer: OnSemi; AEC-Q: 101; Max Temp: 150 degC; Min Temp: -55 degC; Forward Voltage: 1.25V @150mA; Power: 200mW; Value: 100V 200mA; Manufacturer Part Number: SBAS16HT1G; Supplier: Mouser; Package: SOD 323; Category: Diode; RoHS: Yes; ComponentLink1Description: Datasheet; ComponentLink1URL: https://www.onsemi.com/pdf/datasheet/bas16ht1-d.pdf; Supplier 1 pricing per Unit: 10.84 INR; Supplier 1: Digikey; Value 1: SBAS16HT1G; Voltage: 100V; Supplier 1 Part Number: SBAS16HT1GOSCT-ND; Supplier Part Number: 863-SBAS16HT1G; Supplier pricing per Unit: 15.01 INR; Mount Type: Surface Mount; Forward Current: 200mA
J1 = Con_61900411121: Connector Header Through Hole 4 position 0.100" (2.54mm); Alternate Part Number: 61900411021; Crimp Part Number: 61900113722; Manufacturer: Wurth Electronik; Mating Part Number: 61900411621; Circuits: 4; No. of Rows: 1; Value: 4 Pin; Category: Connector; Colour: Natural; ComponentLink1Description: Datasheet; ComponentLink1URL: https://www.we-online.com/components/products/datasheet/6190xx11121.pdf; Manufacturer Part Number: 61900411121; Mount Type: TH; Package: THT; Pitch: 2.54 mm; RoHS: Yes; Supplier 1: Digikey; Supplier 1 Part Number: 732-2697-ND; Supplier 1 pricing per Unit: 77.84 INR; Supplier: Mouser; Supplier Part Number: 710-61900411121; Supplier pricing per Unit: 78.4 INR; Value 1: 61900411121
J2 = Con_559591230: 2.00mm Pitch MicroClasp Wire-to-Board Header, Dual Row, Right Angle, 12 Circuits; Crimp Part Number: 561349000; Manufacturer: Molex; Manufacturer Part Number: 0559591230; Mating Part Number: 513531200; AEC-Q: NA; Circuits: 12; Rows: 2; Value: 12 Pin; Category: Connector; Colour: Natural; RoHS: Yes; Supplier 1: Digikey; Supplier 1 Part Number: WM12307-ND; Supplier: Mouser; Supplier Part Number: 538-55959-1230; Supplier 1 pricing per Unit: 92.91 INR; Supplier pricing per Unit: 87.57 INR; Pitch: 2.00 mm; ComponentLink1Description: Datasheet; ComponentLink1URL: https://www.molex.com/en-us/products/part-detail-pdf/559591230?display=pdf; Mount Type: TH; Package: THT; Value 1: 559591230
J12 = Con_705550017: Connector Header Through Hole, Right Angle 18 position 0.100" (2.54mm); Alternate Part Number: 705550052; Crimp Part Number: 16020069; Manufacturer: Molex; Mating Part Number: 50579418; AEC-Q: NA; Circuits: 18; No. of Rows: 1; Value: 18 Pin; Category: Connector; Colour: Black; ComponentLink1Description: Datasheet; ComponentLink1URL: https://www.molex.com/en-us/products/part-detail-pdf/705550017?display=pdf; Manufacturer Part Number: 705550017; Mount Type: TH; Package: THT; Pitch: 2.54 mm; RoHS: Yes; Rows: 1; Supplier 1: Digikey; Supplier 1 Part Number: WM23533-ND; Supplier 1 pricing per Unit: 119.89 INR; Supplier: Mouser; Supplier Part Number: 538-70555-0017; Supplier pricing per Unit: 100.01 INR; Value 1: 0705550017
LED1 = LED_150060RS75000: Red 625nm LED Indication - Discrete 2V 0603 (1608 Metric); Manufacturer: Wurth Electronik; Value: 30mA (Cont); Max Temp: 85 degC; Min Temp: -40 degC; AEC-Q: NA; Power: 72mW; Manufacturer Part Number: 150060RS75000; Colour: Red; Package: 0603; Category: LED; ComponentLink1Description: Datasheet; ComponentLink1URL: https://www.we-online.com/components/products/datasheet/150060RS75000.pdf; Mount Type: Surface Mount; RoHS: Yes; Supplier 1: Digikey; Supplier 1 Part Number: 732-4978-1-ND; Supplier 1 pricing per Unit: 12.51 INR; Supplier: Mouser; Supplier Part Number: 710-150060RS75000; Supplier pricing per Unit: 12.51 INR; Value 1: 150060RS75000
Q12-Q15 Q17-Q29 = FET_DMG2302UK-7: N-Channel 20 V 2.8A (Ta) 660mW (Ta) Surface Mount SOT-23-3; Manufacturer: Diodes Inc.; AEC-Q: 101; Forward Voltage: 20V; Max Temp: 150 degC; Min Temp: -55 degC; Rds ON: 90mOhms @ 3.6A, 4.5V; Manufacturer Part Number: DMG2302UK-7; Value: 20V 2.8A; RoHS: Yes; Category: MOSFET; ComponentLink1Description: Datasheet; ComponentLink1URL: https://www.diodes.com/assets/Datasheets/DMG2302UK.pdf; Forward Current: 2.8A; Mount Type: Surface Mount; Package: SOT 23-3; Power: 660mW; Supplier 1: Digikey; Supplier 1 Part Number: DMG2302UK-7DICT-ND; Supplier 1 pricing per Unit: 28.35 INR; Supplier: Mouser; Supplier Part Number: 621-DMG2302UK-7; Supplier pricing per Unit: 22.52 INR; Value 1: DMG2302UK-7; Voltage: 20V
  Q12-Q15 Q17-Q20 Q22-Q29: Channel: N-Channel
  Q21: Alternate 2 Part Number (Right Angled): N-Channel
Q16 = BJT_FCX495TA: Bipolar (BJT) Transistor NPN 150 V 1 A 100MHz 1 W Surface Mount SOT-89-3; Manufacturer: Diodes Inc.; Value: 150V 1A; Power: 1W; Voltage: 150V; AEC-Q: 101; Max Temp: 150 degC; Min Temp: -65 degC; Package: SOT 89-3; Manufacturer Part Number: FCX495TA; Category: BJT; RoHS: Yes; Supplier 1 pricing per Unit: 38.37 INR; ComponentLink1Description: Datasheet; ComponentLink1URL: https://www.diodes.com/assets/Datasheets/FCX495.pdf; Supplier 1: Digikey; Supplier: Mouser; Value 1: FCX495TA; Supplier 1 Part Number: FCX495CT-ND; Supplier Part Number: 522-FCX495TA; Supplier pricing per Unit: 27.52 INR; Mount Type: Surface Mount; Technology: BJT; Channel: NPN
R24 R27 R30 R35 R41 R46 R49 R52 R55 R59 R63 R66 R69 R72 R75 R78 R81 = Res_CRCW060320R0FKEAHP: SMD Chip Resistor, 20 Ohm, ± 1%, 330 mW, 0603 [1608 Metric], Thick Film, General Purpose; Manufacturer: Vishay Dale; Value: 20R; Power: 1/10W; AEC-Q: 200; Max Temp: 155 degC; Min Temp: -55 degC; Package: 0603; Manufacturer Part Number: CRCW060320R0FKEAHP; Tolerance: 1%; Category: Resistor; RoHS: Yes; Supplier: Mouser; Supplier 1 pricing per Unit: 12.51 INR; ComponentLink1Description: Datasheet; ComponentLink1URL: https://www.vishay.com/docs/20043/crcwhpe3.pdf; Supplier 1: Digikey; Value 1: CRCW060320R0FKEAHP; Supplier 1 Part Number: 541-20.0SCT-ND; Supplier Part Number: 71-CRCW060320R0FKEAH; Supplier pricing per Unit: 12.51 INR; Mount Type: Surface Mount
R25 R28 R31 R37 R42 R47 R50 R53 R57 R61 R64 R67 R70 R73 R76 R79 = Res_RC2512FK-0720RL: SMD Chip Resistor, 20 Ohm Resistor, 1 W, 2512 [6432 Metric], Thick Film, General Purpose; Manufacturer: Yageo; AEC-Q: NA; Max Temp: 155 degC; Min Temp: -55 degC; Power: 1W; Tolerance: 1%; Value: 20R; Category: Resistor; ComponentLink1Description: Datasheet; ComponentLink1URL: https://www.yageo.com/upload/media/product/products/datasheet/rchip/PYu-RC_Group_51_RoHS_L_12.pdf; Manufacturer Part Number: RC2512FK-0720RL; Mount Type: Surface Mount; Package: 2512; RoHS: Yes; Supplier 1: Digikey; Supplier 1 Part Number: 13-RC2512FK-0720RLCT-ND; Supplier 1 pricing per Unit: 27.67 INR; Supplier: Mouser; Supplier Part Number: 603-RC2512FK-0720RL; Supplier pricing per Unit: 26.69 INR; Value 1: RC2512FK-0720RL
R26 R29 R34 R40 R43 R48 R51 R54 R56 R58 R60 R62 R65 R68 R71 R74 R77 R80 = Res_CRCW060310K0FKEA: SMD Chip Resistor, 10 kOhm,±1%, 100 mW, 0603 [1608 Metric], Thick Film, General Purpose; Manufacturer: Vishay Dale; AEC-Q: 200; Max Temp: 155 degC; Min Temp: -55 degC; Power: 1/10W; Value: 10k R; Category: Resistor; ComponentLink1Description: Datasheet; ComponentLink1URL: https://www.vishay.com/docs/20035/dcrcwe3.pdf; Manufacturer Part Number: CRCW060310K0FKEA; Mount Type: Surface Mount; Package: 0603; RoHS: Yes; Supplier 1: Digikey; Supplier 1 Part Number: 541-10.0KHCT-ND; Supplier 1 pricing per Unit: 8.34 INR; Supplier: Mouser; Supplier Part Number: 71-CRCW0603-10K-E3; Supplier pricing per Unit: 8.34 INR; Tolerance: 1%; Value 1: CRCW060310K0FKEA
R32 R33 R36 R38 = Res_CRCW2512220RJNEG: SMD Chip Resistor, 220 Ohm, ± 1%, 1 W, 2512 [6432 Metric], Thick Film, General Purpose; Manufacturer: Vishay Dale; Value: 220R; Tolerance: 5%; Power: 1W; AEC-Q: 200; Max Temp: 155 degC; Min Temp: -55 degC; Package: 2512; RoHS: Yes; Manufacturer Part Number: CRCW2512220RJNEG; Supplier: Mouser; Supplier 1: Digikey; Category: Resistor; ComponentLink1Description: Datasheet; ComponentLink1URL: https://www.vishay.com/docs/20035/dcrcwe3.pdf; Mount Type: Surface Mount; Supplier 1 Part Number: 541-220XCT-ND; Supplier 1 pricing per Unit: 26.68 INR; Supplier Part Number: 71-CRCW2512J-220-E3; Supplier pricing per Unit: 26.68 INR; Value 1: CRCW2512220RJNEG
R39 = Res_AC0603FR-10200RL: SMD Chip Resistor,200 Ohms ±1% 0.1W, 1/10W, 0603 (1608 Metric) Anti-Sulfur, Automotive AEC-Q200 Thick Film; Manufacturer: Yageo; Value: 200R; Max Temp: 155 degC; Min Temp: -55 degC; AEC-Q: 200; Manufacturer Part Number: AC0603FR-10200RL; Tolerance: 1%; Category: Resistor; ComponentLink1Description: Datasheet; ComponentLink1URL: https://www.yageo.com/upload/media/product/productsearch/datasheet/rchip/PYu-AC_51_RoHS_L_10.pdf; Mount Type: Surface Mount; Package: 0603; Power: 1/10W; RoHS: Yes; Supplier 1: Digikey; Supplier 1 Part Number: 13-AC0603FR-10200RLCT-ND; Supplier 1 pricing per Unit: 8.34 INR; Supplier: Mouser; Supplier Part Number: 603-AC0603FR-10200RL; Supplier pricing per Unit: 8.34 INR; Value 1: AC0603FR-10200RL
R44 R45 = Res_AF0603FR-07100RL: SMD Chip Resistor,100 Ohms ±1%, 1/10W, 0603 (1608 Metric) Anti-Sulfur, Automotive AEC-Q200 Thick Film; Manufacturer: Yageo; Value: 100R; AEC-Q: 200; Max Temp: 155 degC; Min Temp: -55 degC; Category: Resistor; Tolerance: 1%; Package: 0603; Manufacturer Part Number: AF0603FR-07100RL; RoHS: Yes; Power: 1/10W; Supplier: Mouser; Supplier 1 pricing per Unit: 8.34 INR; ComponentLink1Description: Datasheet; ComponentLink1URL: https://www.yageo.com/upload/media/product/app/datasheet/rchip/pyu-af_51_rohs_l.pdf; Supplier 1: Digikey; Value 1: AF0603FR-07100RL; Supplier 1 Part Number: 13-AC0603FR-10150RLCT-ND; Supplier Part Number: 603-AF0603FR-07100RL; Supplier pricing per Unit: 8.34 INR; Mount Type: Surface Mount
U1 = IC_BQ7695203: SPI 5V LDO enabled; Manufacturer: Texas Instruments; Manufacturer Part Number: BQ7695203PFBR; Value: BQ7695203PFBR; AEC-Q: NA; Max Temp: 85 degC; Min Temp: -40 degC; Communication: SPI; Package: TQFP; RoHS: Yes; Category: Battery Management IC; LDO: 5V; Supplier: Mouser; ComponentLink1Description: Datasheet; ComponentLink1URL: https://www.ti.com/lit/ds/symlink/bq76952.pdf?ts=1714053938138&ref_url=https%253A%252F%252Fwww.ti.com%252Fproduct%252FBQ76952; Supplier 1 pricing per Unit: 451.09 INR; Supplier 1: Digikey; Value 1: BQ7695203PFBR; Supplier 1 Part Number: 296-BQ7695203PFBRCT-ND; Supplier Part Number: 595-BQ7695203PFBR; Supplier pricing per Unit: 443.85 INR; Mount Type: Surface Mount

## Sheet ESP32_S3.SchDoc
size A3; SheetNumber: 8; SheetTotal: 12
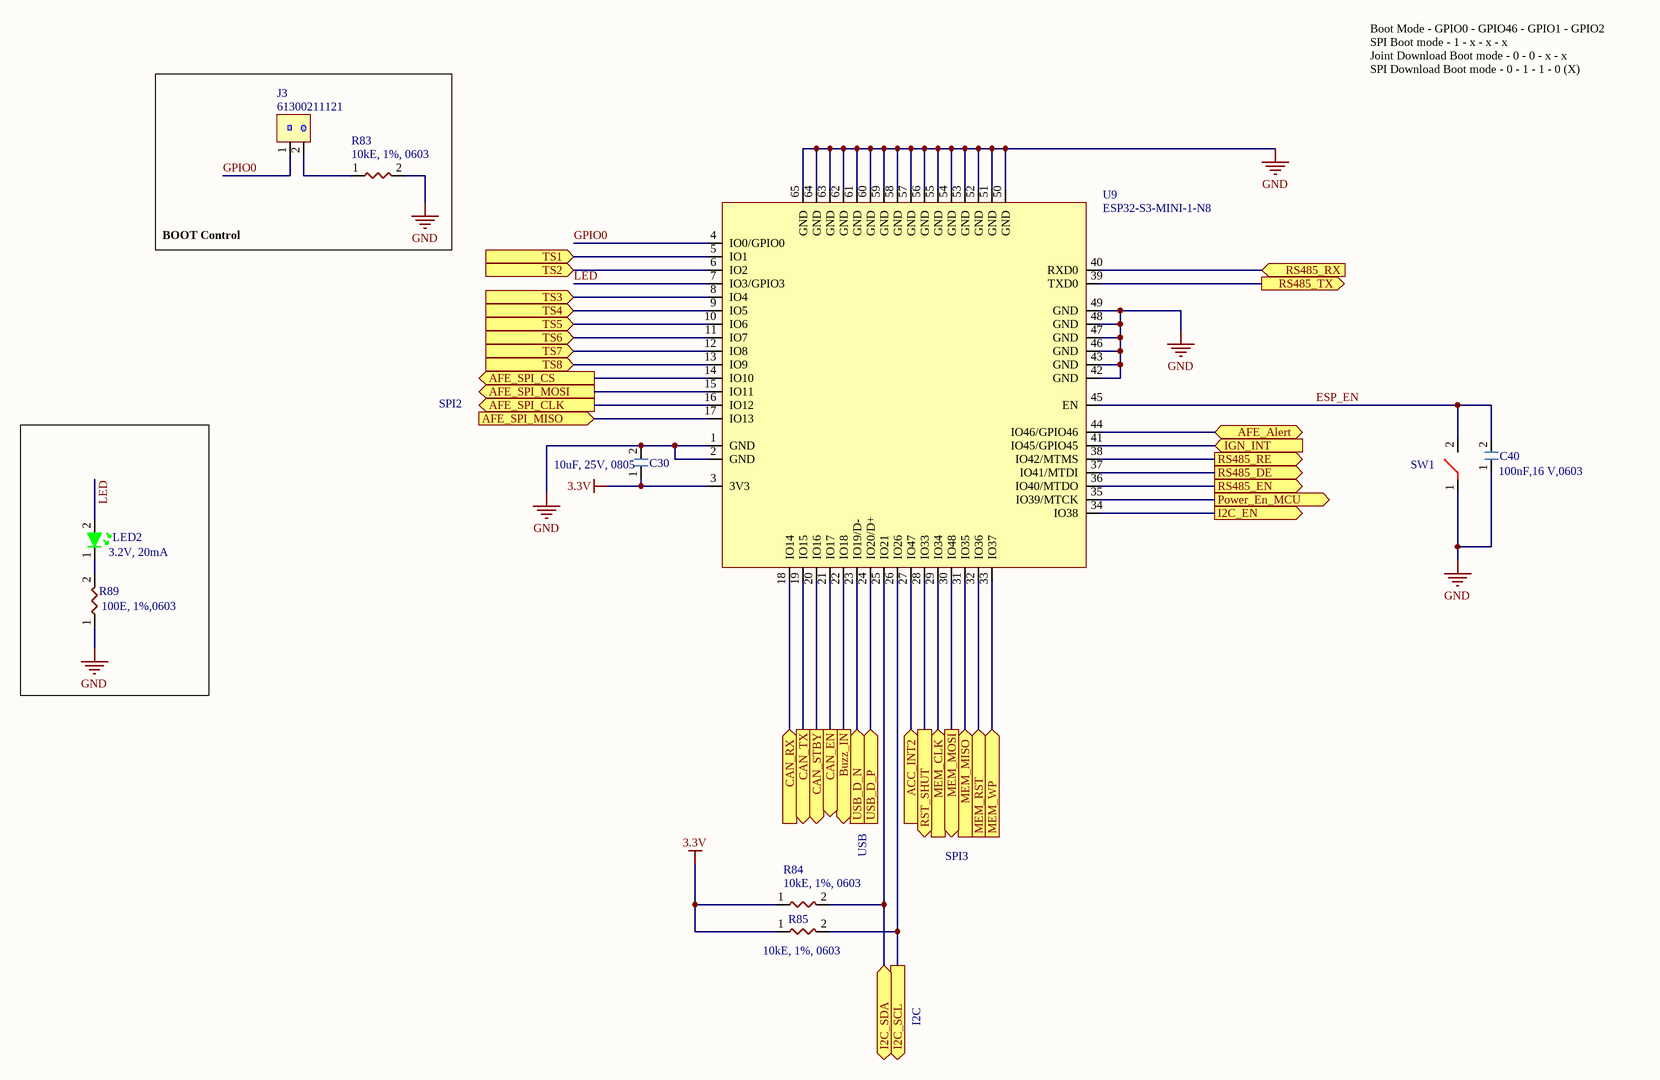
[diagram p3: ESP32_S3.SchDoc]

### Parts
C30  Value Display: 10uF, 25V, 0805  [CAPC2012X13N 0805]  (hidden comment: GRM21BZ71E106KE15L)
C40  Value Display: 100nF,16 V,0603  [CAPC1608X05N 0603]  (hidden comment: CC0603KRX7R7BB104)
J3  61300211121  [Con_61300211121]
LED2  Value Display: 3.2V, 20mA  [DIOC1610X08N LED]  (hidden comment: 150060GS75000)
R83  Value Display: 10kE, 1%, 0603  [RESC1608X05N 0603]  (hidden comment: CRCW060310K0FKEA)
R84  Value Display: 10kE, 1%, 0603  [RESC1608X05N 0603]  (hidden comment: CRCW060310K0FKEA)
R85  Value Display: 10kE, 1%, 0603  [RESC1608X05N 0603]  (hidden comment: CRCW060310K0FKEA)
R89  Value Display: 100E, 1%,0603  [RESC1608X05N 0603]  (hidden comment: AF0603FR-07100RL)
SW1  TL3305AF260QG  [SW_TL3305AF260QG]  (value not drawn)
U9  ESP32-S3-MINI-1-N8  [ESP32-S3_MINI]

### Blocks framed on the sheet
BOOT Control: J3 R83

### Ports
ACC_INT2 (in), AFE_Alert (bidir), AFE_SPI_CLK (out), AFE_SPI_CS (out), AFE_SPI_MISO (in), AFE_SPI_MOSI (out), Buzz_IN (out), CAN_EN (out), CAN_RX (in), CAN_STBY (out), CAN_TX (out), I2C_EN (out), I2C_SCL (out), I2C_SDA (bidir), IGN_INT (in), MEM_CLK (in), MEM_MISO (in), MEM_MOSI (out), MEM_RST (in), MEM_WP (in), Power_En_MCU (out), RS485_DE (out), RS485_EN (out), RS485_RE (out), RS485_RX (in), RS485_TX (out), RST_SHUT (out), TS1 (in), TS2 (in), TS3 (in), TS4 (in), TS5 (in), TS6 (in), TS7 (in), TS8 (in), USB_D_N (in), USB_D_P (in)

### Nets
3.3V: C30.1 R84.1 R85.1 U9.3(3V3)
GND: C30.2 C40.1 R83.2 R89.1 SW1.1 U9.1(GND) U9.2(GND) U9.42(GND) U9.43(GND) U9.46(GND) U9.47(GND) U9.48(GND) U9.49(GND) U9.50(GND) U9.51(GND) U9.52(GND) U9.53(GND) U9.54(GND) U9.55(GND) U9.56(GND) U9.57(GND) U9.58(GND) U9.59(GND) U9.60(GND) U9.61(GND) U9.62(GND) U9.63(GND) U9.64(GND) U9.65(GND)
ACC_INT2: U9.27(IO47) ; port ACC_INT2
BUZZ_IN: U9.22(IO18) ; port Buzz_IN
CAN_EN: U9.21(IO17) ; port CAN_EN
CAN_RX: U9.18(IO14) ; port CAN_RX
CAN_STBY: U9.20(IO16) ; port CAN_STBY
CAN_TX: U9.19(IO15) ; port CAN_TX
ESP_EN: C40.2 SW1.2 U9.45(EN)
GPIO0: J3.1 U9.4(IO0/GPIO0)
I2C_EN: U9.34(IO38) ; port I2C_EN
I2C_SCL: R85.2 U9.26(IO26) ; port I2C_SCL
I2C_SDA: R84.2 U9.25(IO21) ; port I2C_SDA
IGN_INT: U9.41(IO45/GPIO45) ; port IGN_INT
LED: LED2.2(Anode) U9.7(IO3/GPIO3)
MEM_CLK: U9.29(IO34) ; port MEM_CLK
MEM_MISO: U9.31(IO35) ; port MEM_MISO
MEM_MOSI: U9.30(IO48) ; port MEM_MOSI
MEM_RST: U9.32(IO36) ; port MEM_RST
MEM_WP: U9.33(IO37) ; port MEM_WP
Power_En_MCU: U9.35(IO39/MTCK) ; port Power_En_MCU
RS485_DE: U9.37(IO41/MTDI) ; port RS485_DE
RS485_EN: U9.36(IO40/MTDO) ; port RS485_EN
RS485_RE: U9.38(IO42/MTMS) ; port RS485_RE
RS485_RX: U9.40(RXD0) ; port RS485_RX
RS485_TX: U9.39(TXD0) ; port RS485_TX
RST_SHUT_MCU: U9.28(IO33) ; port RST_SHUT
SPI_CLK: U9.16(IO12) ; port AFE_SPI_CLK
SPI_CS: U9.14(IO10) ; port AFE_SPI_CS
SPI_MISO: U9.17(IO13) ; port AFE_SPI_MISO
SPI_MOSI: U9.15(IO11) ; port AFE_SPI_MOSI
TS1: U9.5(IO1) ; port TS1
TS2: U9.6(IO2) ; port TS2
TS3: U9.8(IO4) ; port TS3
TS4: U9.9(IO5) ; port TS4
TS5: U9.10(IO6) ; port TS5
TS6: U9.11(IO7) ; port TS6
TS7: U9.12(IO8) ; port TS7
TS8: U9.13(IO9) ; port TS8
USB_D_N: U9.23(IO19/D-) ; port USB_D_N
USB_D_P: U9.24(IO20/D+) ; port USB_D_P
NetJ3_2: J3.2 R83.1
NetLED2_1: LED2.1(Cathode) R89.2
NetU1_25: U9.44(IO46/GPIO46) ; port AFE_Alert

### Notes on the sheet
- Boot Mode - GPIO0 - GPIO46 - GPIO1 - GPIO2
  SPI Boot mode - 1 - x - x - x
  Joint Download Boot mode - 0 - 0 - x - x
  SPI Download Boot mode - 0 - 1 - 1 - 0 (X)
- SPI2
- USB
- SPI3
- I2C

### Library data of the parts
C30 = Cap_GRM21BZ71E106KE15L: Multilayer Ceramic Capacitor, 10 uF, 25V, ±10%,  X7R 0805 (2012 Metric); Manufacturer: Murata; AEC-Q: NA; Max Temp: 125 degC; Min Temp: -55 degC; Polarized: No; Value: 10 uF; Category: Capacitor; ComponentLink1Description: Datasheet; ComponentLink1URL: https://search.murata.co.jp/Ceramy/image/img/A01X/G101/ENG/GRM21BZ71E106KE15-01.pdf; Manufacturer Part Number: GRM21BZ71E106KE15L; Mount Type: Surface Mount; Package: 0805; RoHS: Yes; Supplier 1: Digikey; Supplier 1 Part Number: 490-GRM21BZ71E106KE15LCT-ND; Supplier 1 pricing per Unit: 28.51 INR; Supplier: Mouser; Supplier Part Number: 81-GRM21BZ71E106KE5L; Supplier pricing per Unit: 30.02 INR; Technology: Ceramic; Temp Coefficient: X7R; Tolerance: 10%; Value 1: GRM21BZ71E106KE15L; Voltage: 25V
C40 = Cap_CC0603KRX7R7BB104: as C26 on sheet Monitoring_BQ76952; Manufacturer Part Number: CC0603KRX7R7BB104; Category: Capacitor; ComponentLink1Description: Datasheet; Mount Type: Surface Mount; Package: 0603; RoHS: Yes; Supplier 1: Digikey; Supplier 1 Part Number: 311-1088-1-ND; Supplier 1 pricing per Unit: 8.34 INR; Supplier: Mouser; Supplier Part Number: 603-CC603KRX7R7BB104; Supplier pricing per Unit: 8.34 INR; Technology: Ceramic; Temp Coefficient: X7R; Tolerance: 10%; Value 1: CC0603KRX7R7BB104; Voltage: 16V; ComponentLink1URL: https://www.yageo.com/upload/media/product/productsearch/datasheet/mlcc/UPY-GPHC_X7R_6.3V-to-250V_24.pdf
J3 = Con_61300211121: Connector Header Through Hole 2 position 0.100" (2.54mm); Crimp Part Number: 609002115121; Manufacturer: Wurth Electronik; AEC-Q: NA; Circuits: 2; No. of Rows: 1; Value: 2 Pin; Value Display: 2 Pin/Vert/TH; Alternate 2 Part Number (Right Angled): *; Alternate Part Number: *; Category: Connector; Colour: Black; ComponentLink1Description: Datasheet; ComponentLink1URL: https://www.we-online.com/components/products/datasheet/61300211121.pdf; Manufacturer Part Number: 61300211121; Mating Part Number: 609002115121; Mount Type: TH; Package: THT; Pitch: 2.54 mm; RoHS: Yes; Supplier 1: Digikey; Supplier 1 Part Number: 732-5315-ND; Supplier 1 pricing per Unit: 10.93 INR; Supplier: Mouser; Supplier Part Number: 710-61300211121; Supplier pricing per Unit: 10.84 INR; Value 1: 61300211121
LED2 = LED_150060GS75000: Green 520nm LED Indication - Discrete 3.2V 0603 (1608 Metric); Manufacturer: Wurth Electronik; AEC-Q: NA; Max Temp: 85 degC; Min Temp: -40 degC; Value: 20mA; Power: 105mW; Category: LED; Colour: Green; ComponentLink1Description: Datasheet; ComponentLink1URL: https://www.we-online.com/components/products/datasheet/150060GS75000.pdf; Manufacturer Part Number: 150060GS75000; Mount Type: Surface Mount; Package: 0603; RoHS: Yes; Supplier 1: Digikey; Supplier 1 Part Number: 732-4971-1-ND; Supplier 1 pricing per Unit: 12.51 INR; Supplier: Mouser; Supplier Part Number: 710-150060GS75000; Supplier pricing per Unit: 12.51 INR; Value 1: 150060GS75000
R83-R85 = Res_CRCW060310K0FKEA: as R26 on sheet Monitoring_BQ76952; Category: Resistor; ComponentLink1Description: Datasheet; ComponentLink1URL: https://www.vishay.com/docs/20035/dcrcwe3.pdf; Manufacturer Part Number: CRCW060310K0FKEA; Mount Type: Surface Mount; Package: 0603; RoHS: Yes; Supplier 1: Digikey; Supplier 1 Part Number: 541-10.0KHCT-ND; Supplier 1 pricing per Unit: 8.34 INR; Supplier: Mouser; Supplier Part Number: 71-CRCW0603-10K-E3; Supplier pricing per Unit: 8.34 INR; Tolerance: 1%; Value 1: CRCW060310K0FKEA
R89 = Res_AF0603FR-07100RL: as R44 on sheet Monitoring_BQ76952; Category: Resistor; Tolerance: 1%; Package: 0603; Manufacturer Part Number: AF0603FR-07100RL; RoHS: Yes; Power: 1/10W; Supplier: Mouser; Supplier 1 pricing per Unit: 8.34 INR; ComponentLink1Description: Datasheet; ComponentLink1URL: https://www.yageo.com/upload/media/product/app/datasheet/rchip/pyu-af_51_rohs_l.pdf; Supplier 1: Digikey; Value 1: AF0603FR-07100RL; Supplier 1 Part Number: 13-AC0603FR-10150RLCT-ND; Supplier Part Number: 603-AF0603FR-07100RL; Supplier pricing per Unit: 8.34 INR; Mount Type: Surface Mount
SW1 = Sw_TL3305AF260QG: SWITCH TACTILE SPST-NO 0.05A 12V; Manufacturer: E Switch; Category: Switch; ComponentLink1Description: Datasheet; ComponentLink1URL: https://configured-product-images.s3.amazonaws.com/Datasheets/TL3305.pdf; Manufacturer Part Number: TL3305AF260QG; Mount Type: Surface Mount; Package: SMT; RoHS: Yes; Supplier 1: Digikey; Supplier 1 Part Number: EG5353CT-ND; Supplier 1 pricing per Unit: 17.61 INR; Supplier: Mouser; Supplier Part Number: 612-TL3305AF260QG; Supplier pricing per Unit: 17.51 INR; Value 1: TL3305AF260QG; Value: TL3305AF260QG; Value Display: TL3305AF260QG
U9 = IC_ESP32-S3-MINI-1-N8: Multiprotocol Modules SMD module, ESP32-S3FN8, 8 MB SPI flash, PCB antenna; Manufacturer: Espressif; AEC-Q: NA; Data Flash: 8 MB; Max Temp: 85 degC; Min Temp: -40 degC; Value Display: MCU; Category: MCU; ComponentLink1Description: Datasheet; ComponentLink1URL: https://www.espressif.com/sites/default/files/documentation/esp32-s3-mini-1_mini-1u_datasheet_en.pdf; Manufacturer Part Number: ESP32-S3-MINI-1-N8; Mount Type: Surface Mount; Package: Module; RoHS: Yes; Supplier 1: Digikey; Supplier 1 Part Number: 1965-ESP32-S3-MINI-1-N8CT-ND; Supplier 1 pricing per Unit: 259.84 INR; Supplier: Mouser; Supplier Part Number: 356-ESP32-S3-MINI1N8; Supplier pricing per Unit: 258.54 INR; Value 1: ESP32-S3-MINI-1-N8; Value: ESP32-S3-MINI-1-N8